# Altium schematic sheet SX1302.SchDoc: SX1302
size A2; Author: Lucas Liaño; Revision: 1; SheetNumber: 3; SheetTotal: 8
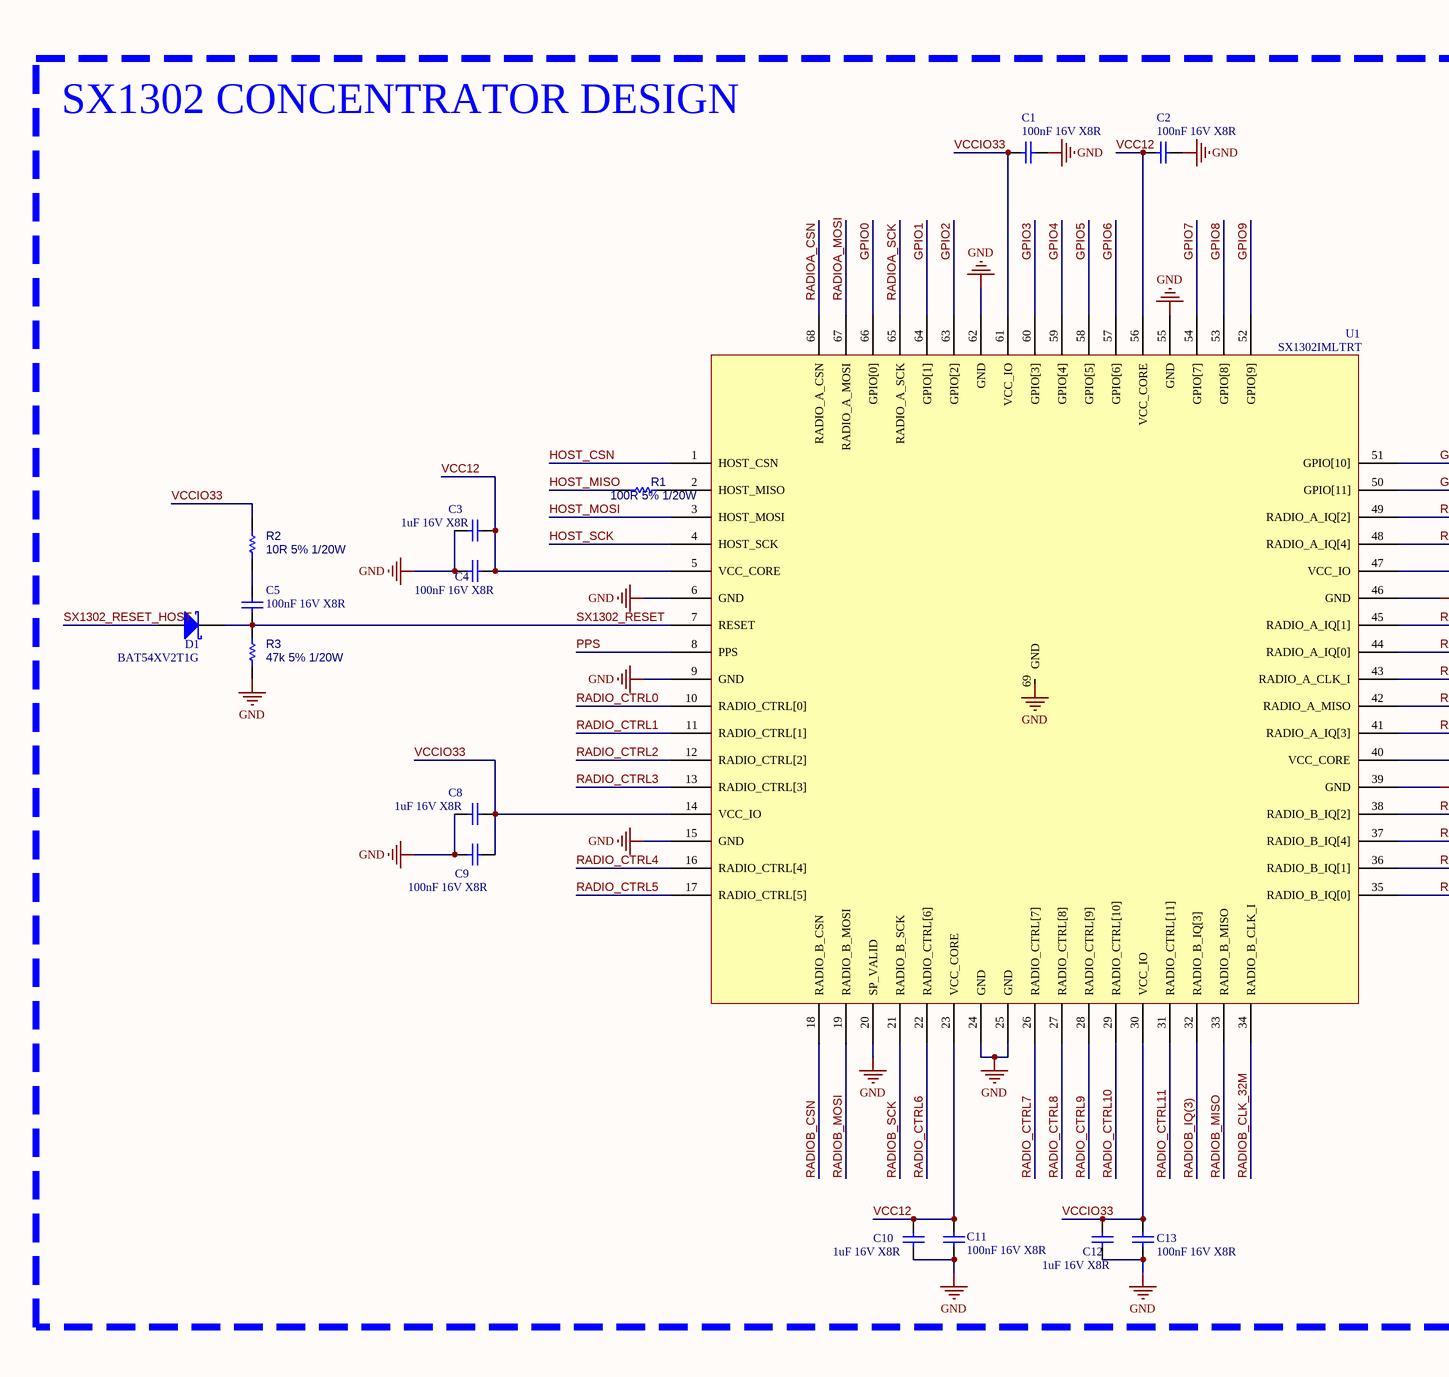
[diagram p0: SX1302.SchDoc, left]
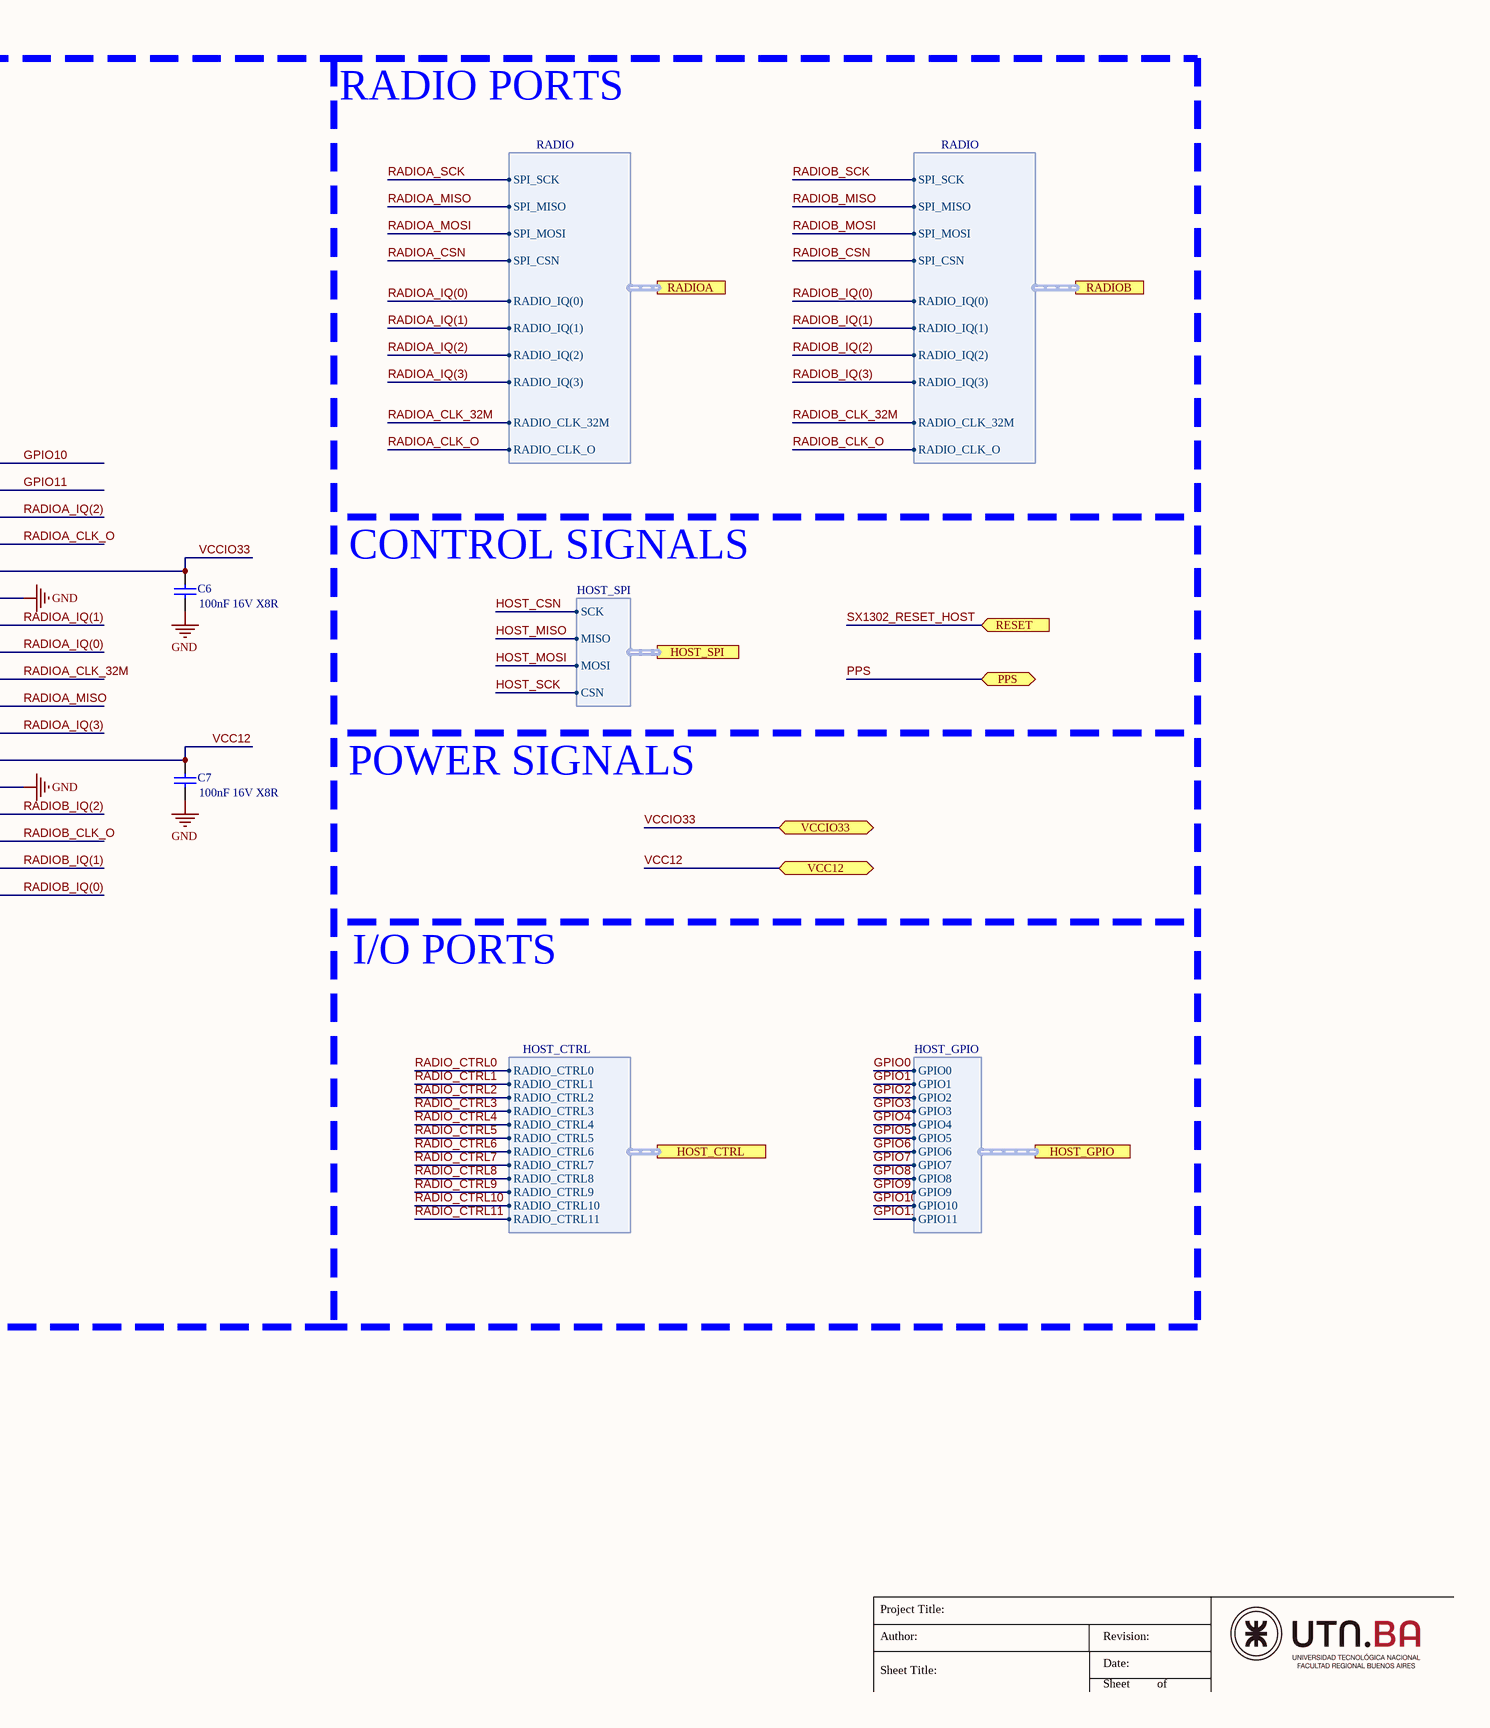
[diagram p1: SX1302.SchDoc, right]

## Parts
C1  100nF 16V X8R  [C_0603]
C2  100nF 16V X8R  [C_0603]
C3  1uF 16V X8R  [C_0603]
C4  100nF 16V X8R  [C_0603]
C5  100nF 16V X8R  [C_0603]
C6  100nF 16V X8R  [C_0603]
C7  100nF 16V X8R  [C_0603]
C8  1uF 16V X8R  [C_0603]
C9  100nF 16V X8R  [C_0603]
C10  1uF 16V X8R  [C_0603]
C11  100nF 16V X8R  [C_0603]
C12  1uF 16V X8R  [C_0603]
C13  100nF 16V X8R  [C_0603]
D1  BAT54XV2T1G  [SOD-523]
R1  100R 5% 1/20W  [0603[1608]]
R2  10R 5% 1/20W  [0603[1608]]
R3  47k 5% 1/20W  [0603[1608]]
U1  SX1302IMLTRT  [vqfn68_7x7mm]

## Blocks framed on the sheet
SX1302 CONCENTRATOR DESIGN: C1-C13 D1 R1-R3 U1

## Ports
HOST_CTRL (harness HOST_CTRL), HOST_GPIO (harness HOST_GPIO), HOST_SPI (harness HOST_SPI), PPS (bidir), RADIOA (harness RADIO), RADIOB (harness RADIO), RESET (in), VCC12 (bidir), VCCIO33 (bidir)

## Harnesses
RADIO: SPI_SCK, SPI_MISO, SPI_MOSI, SPI_CSN, RADIO_IQ(0), RADIO_IQ(1), RADIO_IQ(2), RADIO_IQ(3), RADIO_CLK_32M, RADIO_CLK_O
HOST_SPI: SCK, MISO, MOSI, CSN
HOST_CTRL: RADIO_CTRL0, RADIO_CTRL1, RADIO_CTRL2, RADIO_CTRL3, RADIO_CTRL4, RADIO_CTRL5, RADIO_CTRL6, RADIO_CTRL7, RADIO_CTRL8, RADIO_CTRL9, RADIO_CTRL10, RADIO_CTRL11
HOST_GPIO: GPIO1, GPIO2, GPIO3, GPIO4, GPIO5, GPIO6, GPIO7, GPIO8, GPIO9, GPIO10, GPIO11, GPIO0

## Nets
GND: C1.1 C2.1 C3.1 C4.1 C6.1 C7.1 C8.1 C9.1 C10.1 C11.1 C12.1 C13.1 R3.1 U1.6(GND) U1.9(GND) U1.15(GND) U1.20(SP_VALID) U1.24(GND) U1.25(GND) U1.39(GND) U1.46(GND) U1.55(GND) U1.62(GND) U1.69(GND)
GPIO0: U1.66(GPIO[0]) ; port HOST_GPIO.GPIO0
GPIO1: U1.64(GPIO[1]) ; port HOST_GPIO.GPIO1
GPIO2: U1.63(GPIO[2]) ; port HOST_GPIO.GPIO2
GPIO3: U1.60(GPIO[3]) ; port HOST_GPIO.GPIO3
GPIO4: U1.59(GPIO[4]) ; port HOST_GPIO.GPIO4
GPIO5: U1.58(GPIO[5]) ; port HOST_GPIO.GPIO5
GPIO6: U1.57(GPIO[6]) ; port HOST_GPIO.GPIO6
GPIO7: U1.54(GPIO[7]) ; port HOST_GPIO.GPIO7
GPIO8: U1.53(GPIO[8]) ; port HOST_GPIO.GPIO8
GPIO9: U1.52(GPIO[9]) ; port HOST_GPIO.GPIO9
GPIO10: U1.51(GPIO[10]) ; port HOST_GPIO.GPIO10
GPIO11: U1.50(GPIO[11]) ; port HOST_GPIO.GPIO11
HOST_CSN: U1.1(HOST_CSN) ; port HOST_SPI.SCK
HOST_MISO: R1.2 ; port HOST_SPI.MISO
HOST_MOSI: U1.3(HOST_MOSI) ; port HOST_SPI.MOSI
HOST_SCK: U1.4(HOST_SCK) ; port HOST_SPI.CSN
PPS: U1.8(PPS) ; port PPS
RADIO_CTRL0: U1.10(RADIO_CTRL[0]) ; port HOST_CTRL.RADIO_CTRL0
RADIO_CTRL1: U1.11(RADIO_CTRL[1]) ; port HOST_CTRL.RADIO_CTRL1
RADIO_CTRL2: U1.12(RADIO_CTRL[2]) ; port HOST_CTRL.RADIO_CTRL2
RADIO_CTRL3: U1.13(RADIO_CTRL[3]) ; port HOST_CTRL.RADIO_CTRL3
RADIO_CTRL4: U1.16(RADIO_CTRL[4]) ; port HOST_CTRL.RADIO_CTRL4
RADIO_CTRL5: U1.17(RADIO_CTRL[5]) ; port HOST_CTRL.RADIO_CTRL5
RADIO_CTRL6: U1.22(RADIO_CTRL[6]) ; port HOST_CTRL.RADIO_CTRL6
RADIO_CTRL7: U1.26(RADIO_CTRL[7]) ; port HOST_CTRL.RADIO_CTRL7
RADIO_CTRL8: U1.27(RADIO_CTRL[8]) ; port HOST_CTRL.RADIO_CTRL8
RADIO_CTRL9: U1.28(RADIO_CTRL[9]) ; port HOST_CTRL.RADIO_CTRL9
RADIO_CTRL10: U1.29(RADIO_CTRL[10]) ; port HOST_CTRL.RADIO_CTRL10
RADIO_CTRL11: U1.31(RADIO_CTRL[11]) ; port HOST_CTRL.RADIO_CTRL11
RADIOA_CLK_32M: U1.43(RADIO_A_CLK_I) ; port RADIOA.RADIO_CLK_32M
RADIOA_CLK_O: U1.48(RADIO_A_IQ[4]) ; port RADIOA.RADIO_CLK_O
RADIOA_CSN: U1.68(RADIO_A_CSN) ; port RADIOA.SPI_CSN
RADIOA_IQ(0): U1.44(RADIO_A_IQ[0]) ; port RADIOA.RADIO_IQ(0)
RADIOA_IQ(1): U1.45(RADIO_A_IQ[1]) ; port RADIOA.RADIO_IQ(1)
RADIOA_IQ(2): U1.49(RADIO_A_IQ[2]) ; port RADIOA.RADIO_IQ(2)
RADIOA_IQ(3): U1.41(RADIO_A_IQ[3]) ; port RADIOA.RADIO_IQ(3)
RADIOA_MISO: U1.42(RADIO_A_MISO) ; port RADIOA.SPI_MISO
RADIOA_MOSI: U1.67(RADIO_A_MOSI) ; port RADIOA.SPI_MOSI
RADIOA_SCK: U1.65(RADIO_A_SCK) ; port RADIOA.SPI_SCK
RADIOB_CLK_32M: U1.34(RADIO_B_CLK_I) ; port RADIOB.RADIO_CLK_32M
RADIOB_CLK_O: U1.37(RADIO_B_IQ[4]) ; port RADIOB.RADIO_CLK_O
RADIOB_CSN: U1.18(RADIO_B_CSN) ; port RADIOB.SPI_CSN
RADIOB_IQ(0): U1.35(RADIO_B_IQ[0]) ; port RADIOB.RADIO_IQ(0)
RADIOB_IQ(1): U1.36(RADIO_B_IQ[1]) ; port RADIOB.RADIO_IQ(1)
RADIOB_IQ(2): U1.38(RADIO_B_IQ[2]) ; port RADIOB.RADIO_IQ(2)
RADIOB_IQ(3): U1.32(RADIO_B_IQ[3]) ; port RADIOB.RADIO_IQ(3)
RADIOB_MISO: U1.33(RADIO_B_MISO) ; port RADIOB.SPI_MISO
RADIOB_MOSI: U1.19(RADIO_B_MOSI) ; port RADIOB.SPI_MOSI
RADIOB_SCK: U1.21(RADIO_B_SCK) ; port RADIOB.SPI_SCK
SX1302_RESET: C5.1 D1.1(K) R3.2 U1.7(RESET)
SX1302_RESET_HOST: D1.2(A) ; port RESET
VCC12: C2.2 C3.2 C4.2 C7.2 C10.2 C11.2 U1.5(VCC_CORE) U1.23(VCC_CORE) U1.40(VCC_CORE) U1.56(VCC_CORE) ; port VCC12
VCCIO33: C1.2 C6.2 C8.2 C9.2 C12.2 C13.2 R2.2 U1.14(VCC_IO) U1.30(VCC_IO) U1.47(VCC_IO) U1.61(VCC_IO) ; port VCCIO33
NetC5_2: C5.2 R2.1
NetR1_1: R1.1 U1.2(HOST_MISO)

## Notes on the sheet
- RADIO PORTS
- CONTROL SIGNALS
- POWER SIGNALS
- I/O PORTS
- Project Title:
- Author:
- Sheet Title:
- Date:
- Revision:
- Sheet
- of

## Library data of the parts
C1 C2 C4-C7 C9 C11 C13 = Cap: Capacitor; MPN: C1206C104K4HACAUTO; Manufacturer: KEMET; Package: 0603; Price (USD): 0.3; ComponentLink2Description: SupplierLink; ComponentLink1Description: Datasheet; Value: 100nF 16V X8R; Supplier: Digikey
  C1 C2 C4-C7 C11 C13: ComponentLink2URL: *; ComponentLink1URL: *
  C9: ComponentLink2URL: https://www.digikey.com/es/products/detail/kemet/C1206C104K4HACAUTO/7961523; ComponentLink1URL: https://connect.kemet.com:7667/gateway/IntelliData-ComponentDocumentation/1.0/download/datasheet/C1206C104K4HACAUTO
C3 C8 C10 C12 = Cap: Capacitor; MPN: CGA4J3X8R1C105K125AB; Manufacturer: TDK Corporation; Package: 0603; Price (USD): 0.4; ComponentLink2Description: SupplierLink; ComponentLink1Description: Datasheet; Value: 1uF 16V X8R; Supplier: Digikey
  C3: ComponentLink2URL: https://www.digikey.com/es/products/detail/tdk-corporation/CGA4J3X8R1C105K125AB/3950048; ComponentLink1URL: https://www.digikey.com/es/products/detail/tdk-corporation/CGA4J3X8R1C105K125AB/3950048
  C8 C10 C12: ComponentLink2URL: *; ComponentLink1URL: *
D1 = D Schottky: DIODE SCHOTTKY 30V 200MA SOD523; Manufacturer: onsemi; ComponentLink1Description: Datasheet; ComponentLink1URL: https://www.onsemi.com/pdf/datasheet/bat54xv2t1-d.pdf; ComponentLink2Description: SupplierLink; ComponentLink2URL: https://www.digikey.com/en/products/detail/onsemi/BAT54XV2T1G/918321; MPN: BAT54XV2T1G; Package: SOD-523; Price (USD): 0.26; Supplier: Digikey; Value: DIODE SCHOTTKY 30V 200MA SOD523
R1 = Res: Resistor; Manufacturer: Stackpole; MPN: RMCF0201JT100R; Package: 0603; Price (USD): 0.1; Value: 100R 5% 1/20W; ComponentLink1Description: Datasheet; ComponentLink1URL: *; ComponentLink2Description: SupplierLink; ComponentLink2URL: *; Supplier: Digikey
R2 = Res: Resistor; Manufacturer: CH0402-10RJFPT; MPN: Vishay; Package: 0603; Price (USD): 0.2; Value: 10R 5% 1/20W; ComponentLink1Description: Datasheet; ComponentLink1URL: https://www.vishay.com/docs/53014/ch-cha.pdf; ComponentLink2Description: SupplierLink; ComponentLink2URL: https://www.digikey.com/es/products/detail/vishay-sfernice/CH0402-10RJFPT/10757682; Supplier: Digikey
R3 = Res: Resistor; Manufacturer: Vishay; MPN: M55342K11B47K0MT1V; Package: 0603; Price (USD): 0.2; Value: 47k 5% 1/20W; ComponentLink1Description: Datasheet; ComponentLink1URL: *; ComponentLink2Description: SupplierLink; ComponentLink2URL: *; Supplier: Digikey
U1 = SX1302: LoRa Core™ Digital Baseband Chip for LoRaWAN network gateways; Manufacturer: Semtech; Value: SX1302; ComponentLink1Description: Datasheet; ComponentLink1URL: https://media.digikey.com/pdf/Data%20Sheets/Semtech%20PDFs/SX1302_rev1.1_Jan2020.pdf; ComponentLink2Description: SupplierLink; ComponentLink2URL: https://www.digikey.com/en/products/detail/SX1302IMLTRT/600-SX1302IMLTRTCT-ND/10379524?WT.z_cid=ref_netcomponents_dkc_buynow&utm_source=netcomponents&utm_medium=aggregator&utm_campaign=buynow; MPN: SX1302IMLTRT; Package: QFN 7x7mm P=0.35mm; Price (USD): 37.75; Supplier: Digikey